# EAGLE design LiDAR_Lite_Interface_CAN (EAGLE 9.4.2)
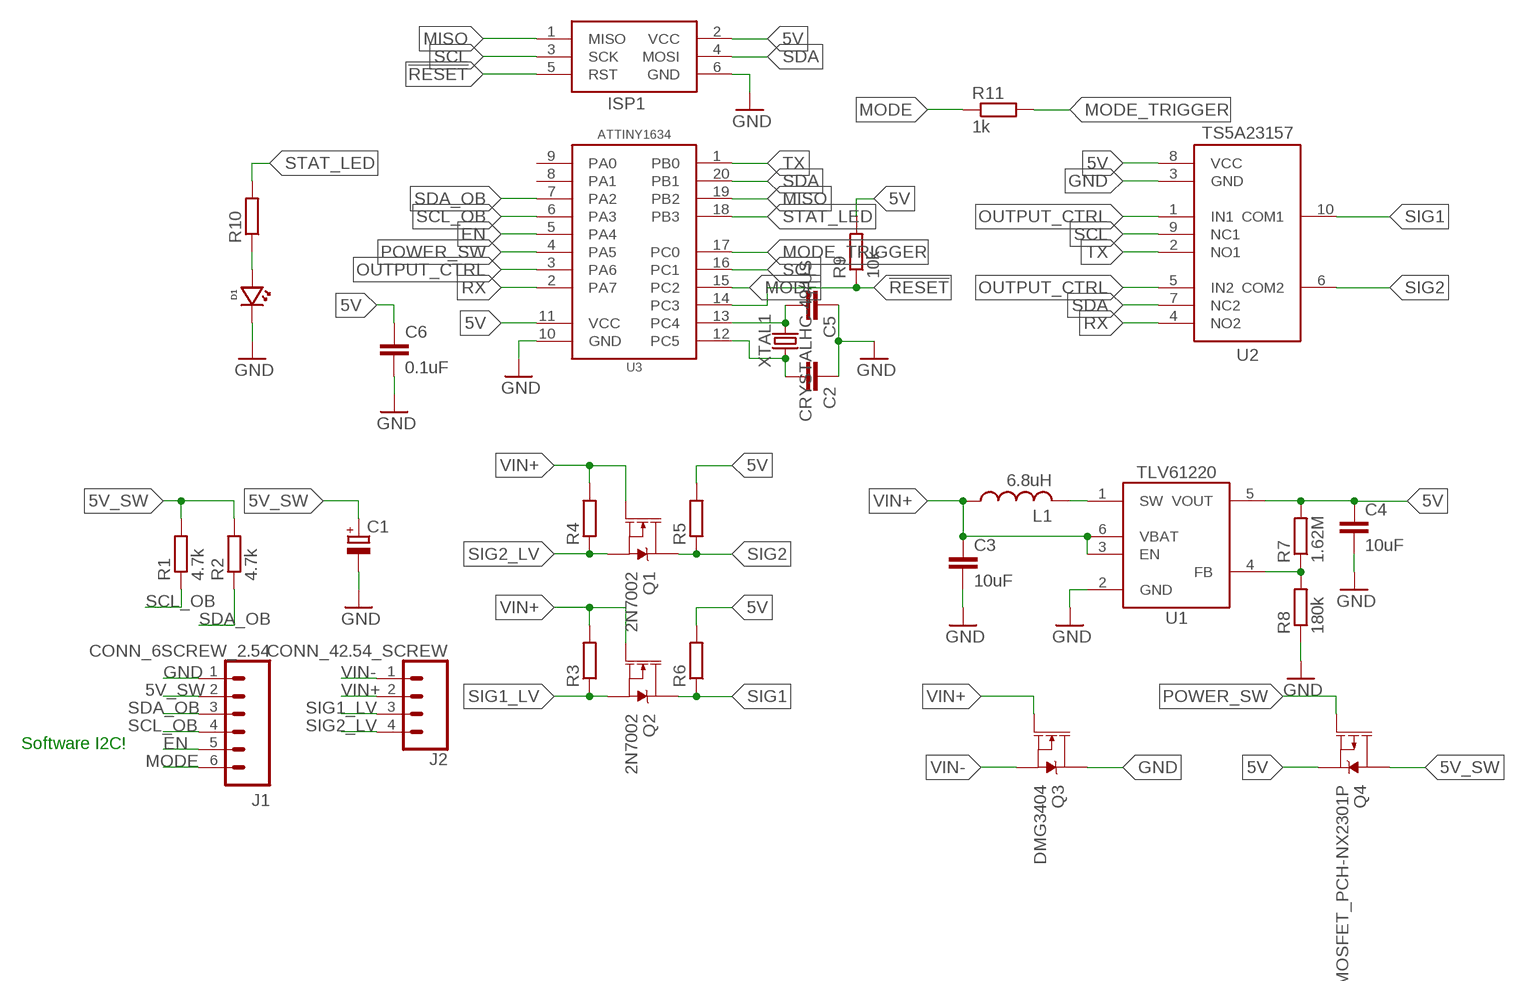
[diagram p0: schematic, sheet 1]

## Parts
C1  CPOL-EUUW-10X10  [UW-10X10_NICHICON]
C2  C-EU10PFC0603  [C0603]
C3  10uF  C-EU10UFC0805  [C0805]
C4  10uF  C-EU10UFC0805  [C0805]
C5  C-EU10PFC0603  [C0603]
C6  0.1uF  C-EU0.1UFC0603  [C0603]
D1  LED0603  [LED_0603]
ISP1  AVRISP-6  [AVRISP]
J1  CONN_6SCREW_2.54  [1X06_SCREW]
J2  CONN_42.54_SCREW  [1X04_SCREW]
L1  6.8uH  INDUCTOR1008  [1008]
Q1  2N7002  MOSFET-NCH-2N7002P  [SOT23-3]
Q2  2N7002  MOSFET-NCH-2N7002P  [SOT23-3]
Q3  DMG3404  MOSFET-NCH-DMG3404L  [SOT23-3]
Q4  MOSFET_PCH-NX2301P  [SOT23-3]
R1  4.7k  R-EU_4.7KR0603  [R0603]
R2  4.7k  R-EU_4.7KR0603  [R0603]
R3  R-EU_10KR0603  [R0603]
R4  R-EU_10KR0603  [R0603]
R5  R-EU_10KR0603  [R0603]
R6  R-EU_10KR0603  [R0603]
R7  1.62M  R-EU_1.62MR0603  [R0603]
R8  180k  R-EU_180KR0603  [R0603]
R9  10k  R-EU_10KR0603  [R0603]
R10  R-EU_330R0603  [R0603]
R11  1k  R-EU_1KR0603  [R0603]
U1  TLV61220DBV  [DBV_R-PDSO-G6]
U2  TS5A23157DGS  [DGS0010A]
U3  ATTINY1634SOIC  [SO-20DW]
XTAL1  CRYSTALHC-49/US  [HC49UP]

## Nets
5V: C4.1 C6.1 ISP1.2(VCC) Q4.2(S) R5.2 R6.2 R7.2 R9.2 U1.5(VOUT) U2.8(VCC) U3.11(VCC)
5V_SW: C1.+ J1.2 Q4.3(D) R1.2 R2.2
!RESET: ISP1.5(RST) R9.1 U3.14(PC3)
EN: J1.5 U3.5(PA4)
GND: C1.- C2.1 C3.2 C4.2 C5.1 C6.2 D1.CATHODE ISP1.6(GND) J1.1 Q3.3(D) R8.1 U1.2(GND) U2.3(GND) U3.10(GND)
MISO: ISP1.1(MISO) U3.19(PB2)
MODE: J1.6 R11.1 U3.15(PC2)
MODE_TRIGGER: R11.2 U3.17(PC0)
N$1: C5.2 U3.13(PC4) XTAL1.2
N$3: C2.2 U3.12(PC5) XTAL1.1
N$4: D1.ANODE R10.1
N$7: R7.1 R8.2 U1.4(FB)
N$9: L1.2 U1.1(SW)
OUTPUT_CTRL: U2.1(IN1) U2.5(IN2) U3.3(PA6)
POWER_SW: Q4.1(G) U3.4(PA5)
RX: U2.4(NO2) U3.2(PA7)
SCL: ISP1.3(SCK) U2.9(NC1) U3.16(PC1)
SCL_OB: J1.4 R1.1 U3.6(PA3)
SDA: ISP1.4(MOSI) U2.7(NC2) U3.20(PB1)
SDA_OB: J1.3 R2.1 U3.7(PA2)
SIG1: Q2.3(D) R6.1 U2.10(COM1)
SIG1_LV: J2.3 Q2.2(S) R3.1
SIG2: Q1.3(D) R5.1 U2.6(COM2)
SIG2_LV: J2.4 Q1.2(S) R4.1
STAT_LED: R10.2 U3.18(PB3)
TX: U2.2(NO1) U3.1(PB0)
VIN+: C3.1 J2.2 L1.1 Q1.1(G) Q2.1(G) Q3.1(G) R3.2 R4.2 U1.3(EN) U1.6(VBAT)
VIN-: J2.1 Q3.2(S)
Unconnected: U3.8(PA1) U3.9(PA0)

## Notes on the sheet
- Software I2C!

## Library data of the parts
C1 = bschulz_passives:CPOL-EU: POLARIZED CAPACITOR, European symbol
C2 C5 = bschulz_passives:C-EU: CAPACITOR, European symbol; DIGIKEY: 311-1058-1-ND; MF: Yageo; MPN: CC0603JRNPO9BN100CC0603JRNPO9BN100
C3 C4 = bschulz_passives:C-EU: CAPACITOR, European symbol; DIGIKEY: 490-6473-6-ND; MF: Murata; MPN: GRM21BR61C106KE15K
C6 = bschulz_passives:C-EU: CAPACITOR, European symbol; DIGIKEY: 490-6051-1-ND; MF: Murata; MPN: GCM188R71E104KA57D
D1 = bschulz:LED: Genaric LED
ISP1 = bschulz:AVRISP: AVR ISP HEADER Standard 6 pin header for AVR programming
J1 = bschulz:CONN_6: Genaric 6 terminal header Digikey 2.54_SCREW <https://www.digikey.com/product-detail/en/on-shore-technology-inc/OSTVN06A150/ED10565-ND/1588866>; DIGIKEY: ED10565-ND; MF: OnShore; MPN: OSTVN06A150
J2 = bschulz:CONN_4: Genaric 4 terminal header Digikey 2.54_SCREW <https://www.digikey.com/product-detail/en/on-shore-technology-inc/OSTVN04A150/ED10563-ND/1588864>; DIGIKEY: ED10563-ND; MF: On Shore; MPN: OSTVN04A150
L1 = bschulz:INDUCTOR: Genaric inductor; DIGIKEY: 732-4849-1-ND; MF: Wurth; MPN: 74438323068
Q1 Q2 = bschulz:MOSFET-NCH: N-channel MOSFETs Voltage controlled devices that allow control of high current outputs. SparkFun Products: SparkFun OpenScale <https://www.sparkfun.com/products/13261> SparkFun Digital Sandbox <https://www.sparkfun.com/products/12651> SparkFun Monster Moto Shield <https://www.sparkfun.com/products/10182> SparkFun MOSFET Power Controller <https://www.sparkfun.com/products/11214>; DIGIKEY: 1727-4692-1-ND; MF: Nexperia; MPN: 2N7002P,215
Q3 = bschulz:MOSFET-NCH: N-channel MOSFETs Voltage controlled devices that allow control of high current outputs. SparkFun Products: SparkFun OpenScale <https://www.sparkfun.com/products/13261> SparkFun Digital Sandbox <https://www.sparkfun.com/products/12651> SparkFun Monster Moto Shield <https://www.sparkfun.com/products/10182> SparkFun MOSFET Power Controller <https://www.sparkfun.com/products/11214>; DIGIKEY: DMG3404L-7DICT-ND; MF: Diodes Incorporated; MPN: DMG3404L-7
Q4 = bschulz:MOSFET_PCH: P-channel MOSFETs Voltage controlled devices that allow control of high current outputs. SparkFun Products: SparkFun ESP32 Thing <https://www.sparkfun.com/products/13907> SparkFun ESP8266 Thing <https://www.sparkfun.com/products/13231>; DIGIKEY: 1727-1148-1-ND; MF: Nexperia; MPN: NX2301P,215
R1 R2 = bschulz_passives:R-EU_: RESISTOR, European symbol Digikey Parts: Yageo, 0402 <https://www.digikey.com/products/en/resistors/chip-resistor-surface-mount/52?k=&pkeyword=&sf=0&FV=ffec1104%2Cfffc000d%2C1c0002%2C440067%2C1f140000%2Cffe00034%2C400004&quantity=&ColumnSort=0&page=1&stock=1&pageSize=25> Yageo, 0603 <https://www.digikey.com/products/en/resistors/chip-resistor-surface-mount/52?k=&pkeyword=&s=4356&s=47360&sf=0&FV=fffc000d%2C1c0002%2C142c040c%2C1f140000%2Cffe00034&quantity=10&ColumnSort=1000011&page=1&stock=1&pageSize=25> Panasonic, 0603 <https://www.digikey.com/products/en/resistors/chip-resistor-surface-mount/52?k=&pkeyword=&pv252=68&sf=0&FV=ffec373d%2C1c0002%2C142c040c%2C1f140000%2Cffe00034%2C80002%2Cc0001&quantity=&ColumnSort=0&page=1&stock=1&pageSize=25> Panasonic, precision, 0603 <https://www.digikey.com/products/en/resistors/chip-resistor-surface-mount/52?FV=ffec4907%2Cfffc000a%2Cc0172%2C142c040c%2C1f140000%2Cffe00034%2C1c0002&quantity=100&ColumnSort=2085&page=1&stock=1&pageSize=25> Panasonic, 0805 <https://www.digikey.com/products/en/resistors/chip-resistor-surface-mount/52?k=&pkeyword=&pv3=1&sf=0&FV=ffec373d%2C1c0002%2C1f140000%2Cffe00034%2C142c040d&quantity=&ColumnSort=0&page=1&stock=1&pageSize=25> Rohm, current sense <https://www.digikey.com/products/en/resistors/chip-resistor-surface-mount/52?k=&pkeyword=&pv3=1&sf=0&FV=ffecb688%2C1f140000%2Cffe00034%2C1c0002&quantity=&ColumnSort=0&page=1&stock=1&pageSize=25> Vishay, pulse proof automotive <https://www.digikey.com/products/en/resistors/chip-resistor-surface-mount/52?k=&pkeyword=&pv7=2&sf=0&FV=ffec5d6b%2Cffe00034%2C1f140000&quantity=&ColumnSort=0&page=1&stock=1&pageSize=25>; DIGIKEY: 311-4.70KHRCT-ND; MF: Yageo; MPN: RC0603FR-074K7L; VALUE_PART: 4.7k
R3-R6 R9 = bschulz_passives:R-EU_: RESISTOR, European symbol Digikey Parts: Yageo, 0402 <https://www.digikey.com/products/en/resistors/chip-resistor-surface-mount/52?k=&pkeyword=&sf=0&FV=ffec1104%2Cfffc000d%2C1c0002%2C440067%2C1f140000%2Cffe00034%2C400004&quantity=&ColumnSort=0&page=1&stock=1&pageSize=25> Yageo, 0603 <https://www.digikey.com/products/en/resistors/chip-resistor-surface-mount/52?k=&pkeyword=&s=4356&s=47360&sf=0&FV=fffc000d%2C1c0002%2C142c040c%2C1f140000%2Cffe00034&quantity=10&ColumnSort=1000011&page=1&stock=1&pageSize=25> Panasonic, 0603 <https://www.digikey.com/products/en/resistors/chip-resistor-surface-mount/52?k=&pkeyword=&pv252=68&sf=0&FV=ffec373d%2C1c0002%2C142c040c%2C1f140000%2Cffe00034%2C80002%2Cc0001&quantity=&ColumnSort=0&page=1&stock=1&pageSize=25> Panasonic, precision, 0603 <https://www.digikey.com/products/en/resistors/chip-resistor-surface-mount/52?FV=ffec4907%2Cfffc000a%2Cc0172%2C142c040c%2C1f140000%2Cffe00034%2C1c0002&quantity=100&ColumnSort=2085&page=1&stock=1&pageSize=25> Panasonic, 0805 <https://www.digikey.com/products/en/resistors/chip-resistor-surface-mount/52?k=&pkeyword=&pv3=1&sf=0&FV=ffec373d%2C1c0002%2C1f140000%2Cffe00034%2C142c040d&quantity=&ColumnSort=0&page=1&stock=1&pageSize=25> Rohm, current sense <https://www.digikey.com/products/en/resistors/chip-resistor-surface-mount/52?k=&pkeyword=&pv3=1&sf=0&FV=ffecb688%2C1f140000%2Cffe00034%2C1c0002&quantity=&ColumnSort=0&page=1&stock=1&pageSize=25> Vishay, pulse proof automotive <https://www.digikey.com/products/en/resistors/chip-resistor-surface-mount/52?k=&pkeyword=&pv7=2&sf=0&FV=ffec5d6b%2Cffe00034%2C1f140000&quantity=&ColumnSort=0&page=1&stock=1&pageSize=25>; DIGIKEY: 311-10.0KHRCT-ND; MF: Yageo; MPN: RC0603FR-0710KL; VALUE_PART: 10k
R7 = bschulz_passives:R-EU_: RESISTOR, European symbol Digikey Parts: Yageo, 0402 <https://www.digikey.com/products/en/resistors/chip-resistor-surface-mount/52?k=&pkeyword=&sf=0&FV=ffec1104%2Cfffc000d%2C1c0002%2C440067%2C1f140000%2Cffe00034%2C400004&quantity=&ColumnSort=0&page=1&stock=1&pageSize=25> Yageo, 0603 <https://www.digikey.com/products/en/resistors/chip-resistor-surface-mount/52?k=&pkeyword=&s=4356&s=47360&sf=0&FV=fffc000d%2C1c0002%2C142c040c%2C1f140000%2Cffe00034&quantity=10&ColumnSort=1000011&page=1&stock=1&pageSize=25> Panasonic, 0603 <https://www.digikey.com/products/en/resistors/chip-resistor-surface-mount/52?k=&pkeyword=&pv252=68&sf=0&FV=ffec373d%2C1c0002%2C142c040c%2C1f140000%2Cffe00034%2C80002%2Cc0001&quantity=&ColumnSort=0&page=1&stock=1&pageSize=25> Panasonic, precision, 0603 <https://www.digikey.com/products/en/resistors/chip-resistor-surface-mount/52?FV=ffec4907%2Cfffc000a%2Cc0172%2C142c040c%2C1f140000%2Cffe00034%2C1c0002&quantity=100&ColumnSort=2085&page=1&stock=1&pageSize=25> Panasonic, 0805 <https://www.digikey.com/products/en/resistors/chip-resistor-surface-mount/52?k=&pkeyword=&pv3=1&sf=0&FV=ffec373d%2C1c0002%2C1f140000%2Cffe00034%2C142c040d&quantity=&ColumnSort=0&page=1&stock=1&pageSize=25> Rohm, current sense <https://www.digikey.com/products/en/resistors/chip-resistor-surface-mount/52?k=&pkeyword=&pv3=1&sf=0&FV=ffecb688%2C1f140000%2Cffe00034%2C1c0002&quantity=&ColumnSort=0&page=1&stock=1&pageSize=25> Vishay, pulse proof automotive <https://www.digikey.com/products/en/resistors/chip-resistor-surface-mount/52?k=&pkeyword=&pv7=2&sf=0&FV=ffec5d6b%2Cffe00034%2C1f140000&quantity=&ColumnSort=0&page=1&stock=1&pageSize=25>; DIGIKEY: RMCF0603FT1M62CT-ND; MF: Stackpole; MPN: RMCF0603FT1M62; VALUE_PART: 1.62M
R8 = bschulz_passives:R-EU_: RESISTOR, European symbol Digikey Parts: Yageo, 0402 <https://www.digikey.com/products/en/resistors/chip-resistor-surface-mount/52?k=&pkeyword=&sf=0&FV=ffec1104%2Cfffc000d%2C1c0002%2C440067%2C1f140000%2Cffe00034%2C400004&quantity=&ColumnSort=0&page=1&stock=1&pageSize=25> Yageo, 0603 <https://www.digikey.com/products/en/resistors/chip-resistor-surface-mount/52?k=&pkeyword=&s=4356&s=47360&sf=0&FV=fffc000d%2C1c0002%2C142c040c%2C1f140000%2Cffe00034&quantity=10&ColumnSort=1000011&page=1&stock=1&pageSize=25> Panasonic, 0603 <https://www.digikey.com/products/en/resistors/chip-resistor-surface-mount/52?k=&pkeyword=&pv252=68&sf=0&FV=ffec373d%2C1c0002%2C142c040c%2C1f140000%2Cffe00034%2C80002%2Cc0001&quantity=&ColumnSort=0&page=1&stock=1&pageSize=25> Panasonic, precision, 0603 <https://www.digikey.com/products/en/resistors/chip-resistor-surface-mount/52?FV=ffec4907%2Cfffc000a%2Cc0172%2C142c040c%2C1f140000%2Cffe00034%2C1c0002&quantity=100&ColumnSort=2085&page=1&stock=1&pageSize=25> Panasonic, 0805 <https://www.digikey.com/products/en/resistors/chip-resistor-surface-mount/52?k=&pkeyword=&pv3=1&sf=0&FV=ffec373d%2C1c0002%2C1f140000%2Cffe00034%2C142c040d&quantity=&ColumnSort=0&page=1&stock=1&pageSize=25> Rohm, current sense <https://www.digikey.com/products/en/resistors/chip-resistor-surface-mount/52?k=&pkeyword=&pv3=1&sf=0&FV=ffecb688%2C1f140000%2Cffe00034%2C1c0002&quantity=&ColumnSort=0&page=1&stock=1&pageSize=25> Vishay, pulse proof automotive <https://www.digikey.com/products/en/resistors/chip-resistor-surface-mount/52?k=&pkeyword=&pv7=2&sf=0&FV=ffec5d6b%2Cffe00034%2C1f140000&quantity=&ColumnSort=0&page=1&stock=1&pageSize=25>; DIGIKEY: P180KHCT-ND; MF: Panasonic; MPN: ERJ-3EKF1803V; VALUE_PART: 180k
R10 = bschulz_passives:R-EU_: RESISTOR, European symbol Digikey Parts: Yageo, 0402 <https://www.digikey.com/products/en/resistors/chip-resistor-surface-mount/52?k=&pkeyword=&sf=0&FV=ffec1104%2Cfffc000d%2C1c0002%2C440067%2C1f140000%2Cffe00034%2C400004&quantity=&ColumnSort=0&page=1&stock=1&pageSize=25> Yageo, 0603 <https://www.digikey.com/products/en/resistors/chip-resistor-surface-mount/52?k=&pkeyword=&s=4356&s=47360&sf=0&FV=fffc000d%2C1c0002%2C142c040c%2C1f140000%2Cffe00034&quantity=10&ColumnSort=1000011&page=1&stock=1&pageSize=25> Panasonic, 0603 <https://www.digikey.com/products/en/resistors/chip-resistor-surface-mount/52?k=&pkeyword=&pv252=68&sf=0&FV=ffec373d%2C1c0002%2C142c040c%2C1f140000%2Cffe00034%2C80002%2Cc0001&quantity=&ColumnSort=0&page=1&stock=1&pageSize=25> Panasonic, precision, 0603 <https://www.digikey.com/products/en/resistors/chip-resistor-surface-mount/52?FV=ffec4907%2Cfffc000a%2Cc0172%2C142c040c%2C1f140000%2Cffe00034%2C1c0002&quantity=100&ColumnSort=2085&page=1&stock=1&pageSize=25> Panasonic, 0805 <https://www.digikey.com/products/en/resistors/chip-resistor-surface-mount/52?k=&pkeyword=&pv3=1&sf=0&FV=ffec373d%2C1c0002%2C1f140000%2Cffe00034%2C142c040d&quantity=&ColumnSort=0&page=1&stock=1&pageSize=25> Rohm, current sense <https://www.digikey.com/products/en/resistors/chip-resistor-surface-mount/52?k=&pkeyword=&pv3=1&sf=0&FV=ffecb688%2C1f140000%2Cffe00034%2C1c0002&quantity=&ColumnSort=0&page=1&stock=1&pageSize=25> Vishay, pulse proof automotive <https://www.digikey.com/products/en/resistors/chip-resistor-surface-mount/52?k=&pkeyword=&pv7=2&sf=0&FV=ffec5d6b%2Cffe00034%2C1f140000&quantity=&ColumnSort=0&page=1&stock=1&pageSize=25>; DIGIKEY: 311-330HRCT-ND; MF: Yageo; MPN: RC0603FR-07330RL; VALUE_PART: 330
R11 = bschulz_passives:R-EU_: RESISTOR, European symbol Digikey Parts: Yageo, 0402 <https://www.digikey.com/products/en/resistors/chip-resistor-surface-mount/52?k=&pkeyword=&sf=0&FV=ffec1104%2Cfffc000d%2C1c0002%2C440067%2C1f140000%2Cffe00034%2C400004&quantity=&ColumnSort=0&page=1&stock=1&pageSize=25> Yageo, 0603 <https://www.digikey.com/products/en/resistors/chip-resistor-surface-mount/52?k=&pkeyword=&s=4356&s=47360&sf=0&FV=fffc000d%2C1c0002%2C142c040c%2C1f140000%2Cffe00034&quantity=10&ColumnSort=1000011&page=1&stock=1&pageSize=25> Panasonic, 0603 <https://www.digikey.com/products/en/resistors/chip-resistor-surface-mount/52?k=&pkeyword=&pv252=68&sf=0&FV=ffec373d%2C1c0002%2C142c040c%2C1f140000%2Cffe00034%2C80002%2Cc0001&quantity=&ColumnSort=0&page=1&stock=1&pageSize=25> Panasonic, precision, 0603 <https://www.digikey.com/products/en/resistors/chip-resistor-surface-mount/52?FV=ffec4907%2Cfffc000a%2Cc0172%2C142c040c%2C1f140000%2Cffe00034%2C1c0002&quantity=100&ColumnSort=2085&page=1&stock=1&pageSize=25> Panasonic, 0805 <https://www.digikey.com/products/en/resistors/chip-resistor-surface-mount/52?k=&pkeyword=&pv3=1&sf=0&FV=ffec373d%2C1c0002%2C1f140000%2Cffe00034%2C142c040d&quantity=&ColumnSort=0&page=1&stock=1&pageSize=25> Rohm, current sense <https://www.digikey.com/products/en/resistors/chip-resistor-surface-mount/52?k=&pkeyword=&pv3=1&sf=0&FV=ffecb688%2C1f140000%2Cffe00034%2C1c0002&quantity=&ColumnSort=0&page=1&stock=1&pageSize=25> Vishay, pulse proof automotive <https://www.digikey.com/products/en/resistors/chip-resistor-surface-mount/52?k=&pkeyword=&pv7=2&sf=0&FV=ffec5d6b%2Cffe00034%2C1f140000&quantity=&ColumnSort=0&page=1&stock=1&pageSize=25>; DIGIKEY: 311-1KLDCT-ND; MF: Yageo; MPN: AC0603FR-071KL; VALUE_PART: 1k
U1 = bschulz:TLV61220: TLV61220 - Low-Input Voltage Step-Up Converter (Boost) Characteristics: Vin: 0.7V ~ 5.5V Vout: 1.8V ~ 5.5V Output Current (Max): 400 mA IQ: 5μA Operating Temperature: -40°C to 85°C Digikey: 296-30547-1-ND <https://www.digikey.com/product-detail/en/texas-instruments/TLV61220DBVR/296-30547-1-ND/3458120>; DIGIKEY: 296-30547-1-ND; MF: TI; MPN: TLV61220DBVR
U2 = bschulz:TS5A23157: TS5A23157 - 2 Channel Multiplexer DPDT Analog Switch Characteristics: VCC: 1.65~5.5V Operating Temperature: -40°C to 85°C On state resistace: 10 Ω, Typ Channel to Channel Matching: 0.15 Ω, Typical Digikey: 296-21919-1-ND (UQFN, RSE) <https://www.digikey.com/product-detail/en/texas-instruments/TS5A23157RSER/296-21919-1-ND/1629272> 296-17076-1-ND (VSSOP, DGS) <https://www.digikey.com/product-detail/en/texas-instruments/TS5A23157DGSR/296-17076-1-ND/659982>; DIGIKEY: 296-17076-1-ND; DISP: TS5A23157; MF: TI; MPN: TS5A23157DGSR
U3 = bschulz:ATTINY1634: ATtiny1634 8 bit AVR Microcontroller Features: Vcc: 1.8 ~ 5.5V Clock: Up to 16MHz, Internal 8MHz FRC, 32kHz RC Flash Memory: 16K SRAM: 1K EEPROM: 256B ADC: 10b, 12 port USART: Yes, x2 SPI: Yes I2C: Yes, slave only Notes: 2 analog comp. Digikey: ATTINY1634R-MURCT-ND (QFN) <https://www.digikey.com/product-detail/en/microchip-technology/ATTINY1634R-MUR/ATTINY1634R-MURCT-ND/3440781> ATTINY1634R-SU-ND (SOIC) <https://www.digikey.com/product-detail/en/ATTINY1634R-SU/ATTINY1634R-SU-ND/3128699/?itemSeq=272981030>; DIGIKEY: ATTINY1634-SURCT-ND; MF: Atmel; MPN: ATTINY1634-SUR
XTAL1 = bschulz:CRYSTAL: Crystal Oscilator 2 Pin quartz crystal oscilators Variants 3.2x1.5mm (Only available in 32.768kHz) <https://www.digikey.com/products/en/crystals-oscillators-resonators/crystals/171?FV=b839bf%2Cb83a33%2C8640001%2C864000f%2C8640003%2C1f140000%2Cmu32.768kHz%7C2150%2Cffe000ab&quantity=10&ColumnSort=1000011&page=1&stock=1&k=crystal&pageSize=25&pkeyword=crystal> 5 x 3.2mm (8MHz ~ 50MHz) <https://www.digikey.com/products/en/crystals-oscillators-resonators/crystals/171?FV=402f3e%2Cb8434d%2C1f140000%2Cffe000ab&quantity=10&ColumnSort=1000011&page=1&stock=1&pageSize=25>

## Board
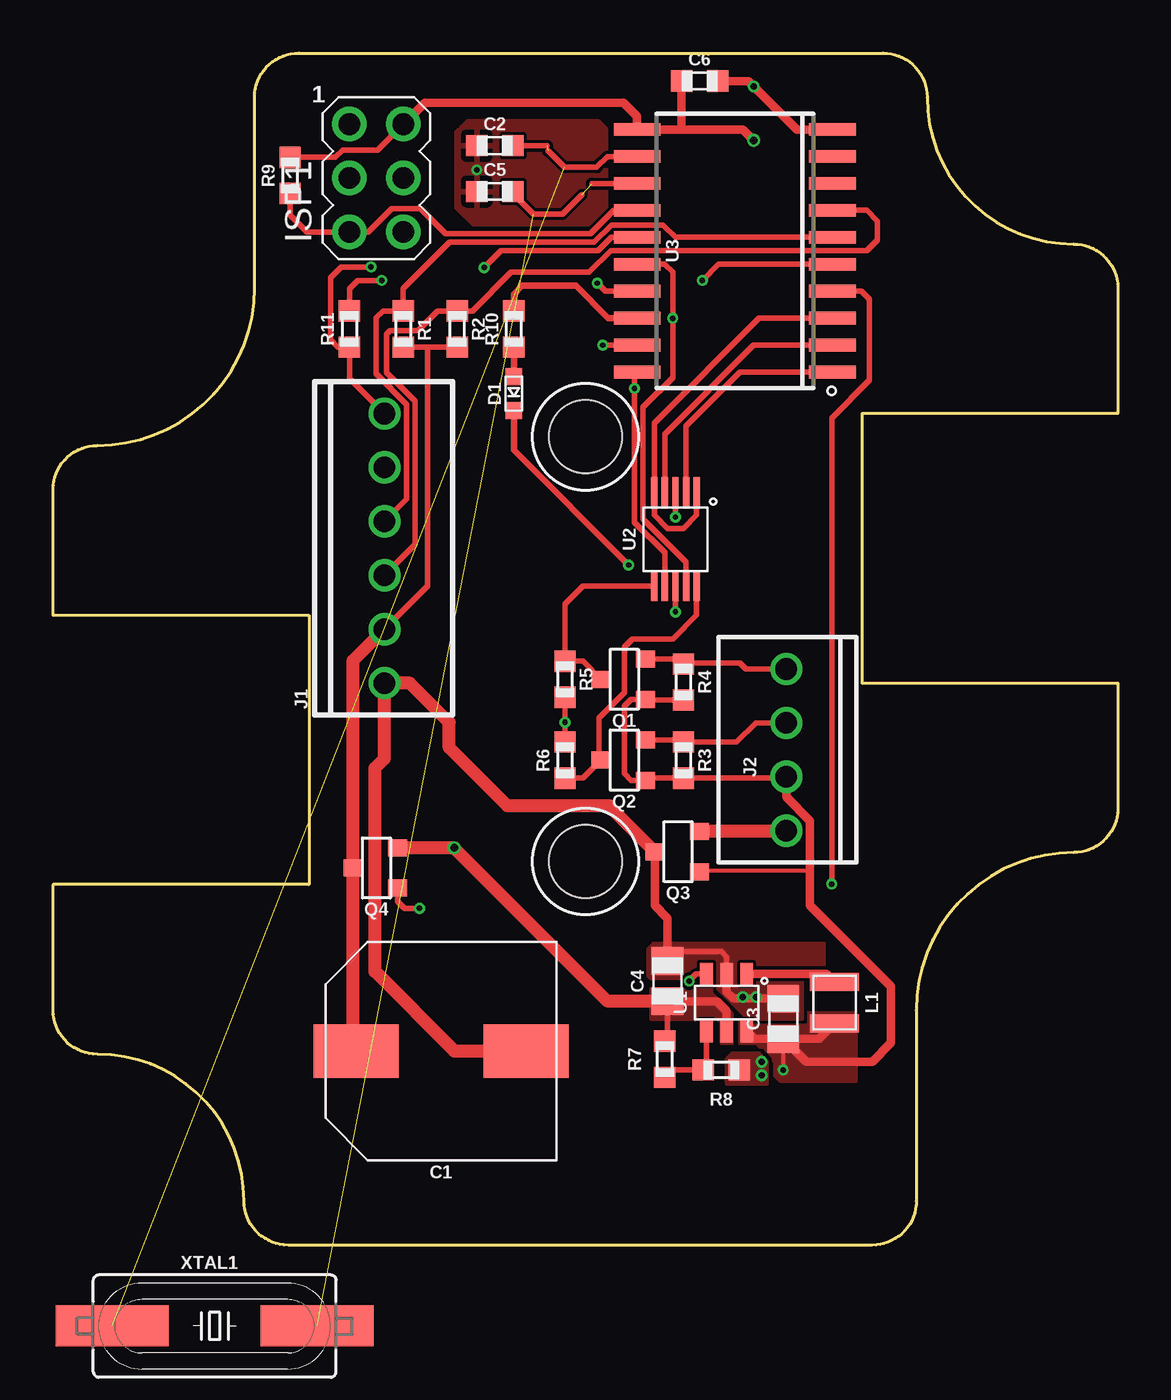
[diagram p1: board, top side]
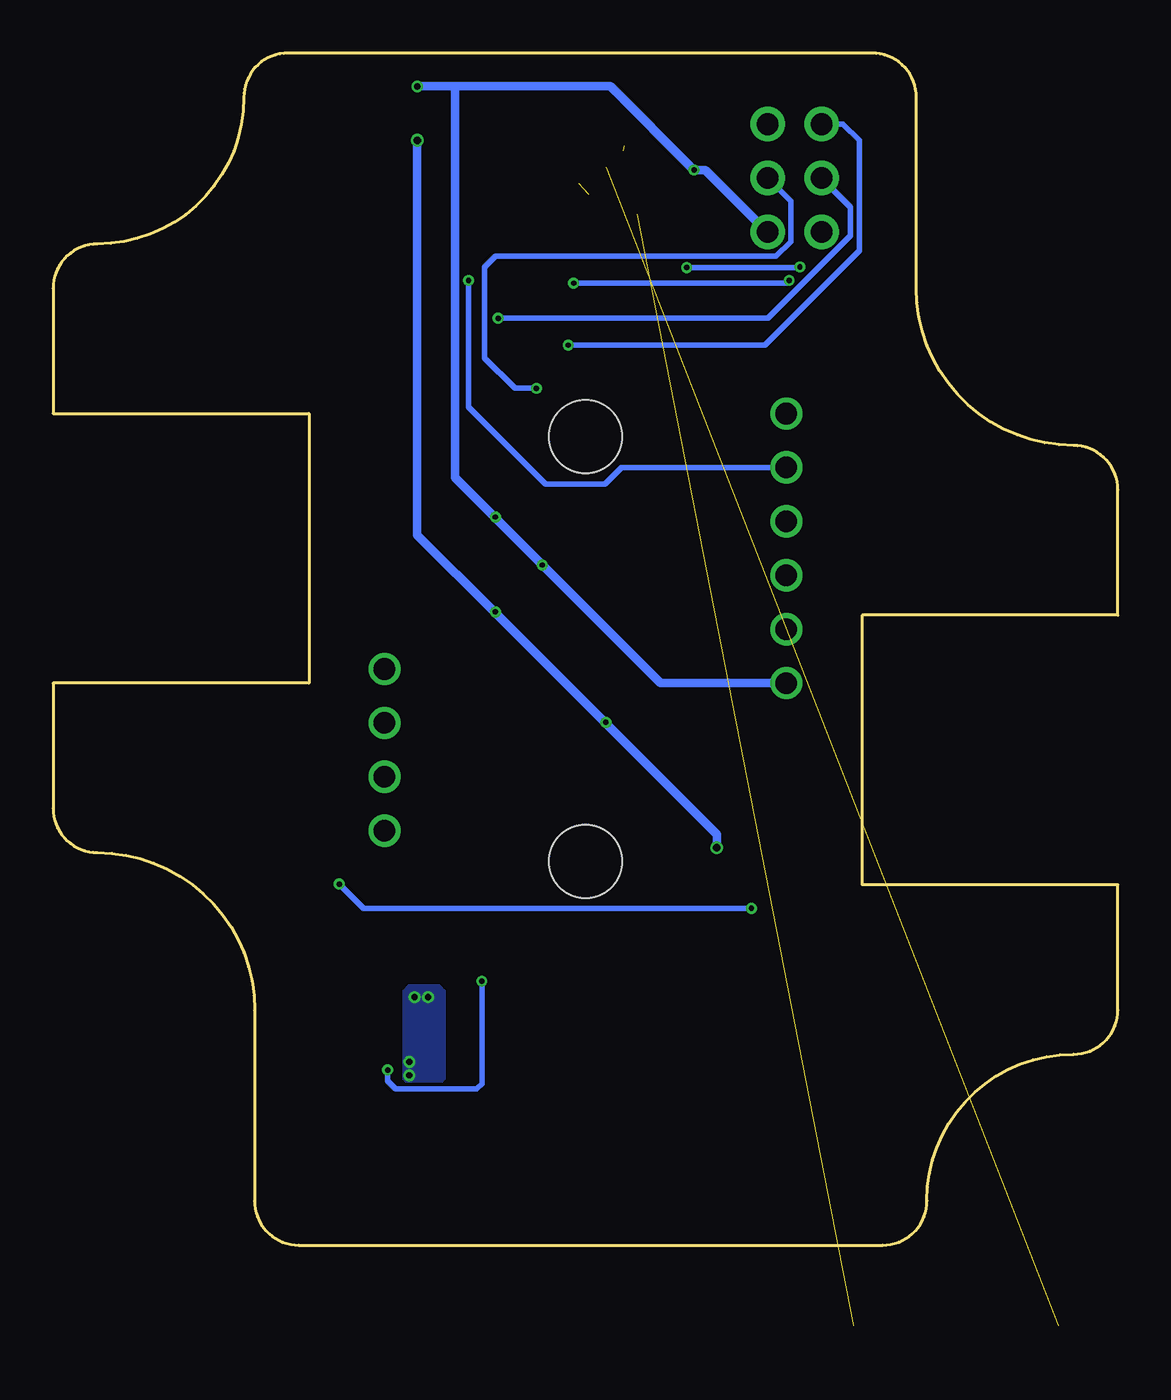
[diagram p2: board, bottom side, seen from below]

Size 50.19 x 56.18 mm. Coordinates in mm from the lower left corner, seen from the top.
Outline: 2.08,37.69 arc90 0,35.61 0,29.69 12.06,29.69 12.06,16.99 0,16.99 0,11.08 arc90 2.08,9 2.1,9 arc-90 9,2.1 9,2.08 arc90 11.08,0 38.61,0 arc90 40.69,2.08 40.69,11.08 arc-90 48.11,18.5
Outline: 2.08,37.69 2.08,37.69
Outline: 2.08,37.69 arc90 9.5,45.11 9.5,54.1 arc-90 11.58,56.19 39.12,56.19 arc-90 41.2,54.1 41.2,54.09 arc90 48.1,47.19 48.11,47.19 arc-90 50.19,45.1 50.19,39.19 38.12,39.19 38.12,26.49 50.19,26.49 50.19,20.58 arc-90 48.11,18.5
Outline: 48.11,18.5 48.11,18.5
Copper layers (1*16): Top 0.035559375mm / dielectric 1.6mm / Bottom 0.035559375mm
Design rules "oshpark-2layer": minimum track width 6mil, minimum drill 10mil, track to track 6mil, track to pad 6mil, pad to pad 6mil, via to via 6mil, smd to smd 6mil, copper to edge 15mil, drill to drill 6mil, minimum pad ring 5mil, minimum via ring 5mil, stop-mask expansion 2.5mil, vias tented up to drill 0mil, thermal gap 10mil
Holes 3.43 mm at 25.1,18.08 25.1,38.1

### Footprints (pad centres in the part's own frame; a part is rotated, then mirrored left to right if it is on the bottom)
UW-10X10_NICHICON = smd 2.5 x 4: + 0,4; - 0,-4
C0603 = smd 1 x 1: 1 -0.85,0; 2 0.85,0
C0805 = smd 1.3 x 1.5: 1 -0.95,0; 2 0.95,0
LED_0603 = smd 0.8 x 0.8: ANODE 0.8,0; CATHODE -0.8,0
AVRISP = drill 1.02 pad 1.626: 1 -1.27,2.54; 2 1.27,2.54; 3 -1.27,0; 4 1.27,0; 5 -1.27,-2.54; 6 1.27,-2.54
1X06_SCREW = drill 1.016: 1 -6.35,0; 2 -3.81,0; 3 -1.27,0; 4 1.27,0; 5 3.81,0; 6 6.35,0
1X04_SCREW = drill 1.016: 1 -3.81,0; 2 -1.27,0; 3 1.27,0; 4 3.81,0
1008 = smd 0.85 x 2.3: 1 -0.975,0; 2 0.975,0
SOT23-3 = smd 0.8 x 0.9: 1 -0.95,-1; 2 0.95,-1; 3 0,1.1
R0603 = smd 1 x 1: 1 -0.85,0; 2 0.85,0
DBV_R-PDSO-G6 = smd 0.6 x 1.05: 1 -0.95,-1.35; 2 0,-1.35; 3 0.95,-1.35; 4 0.95,1.35; 5 0,1.35; 6 -0.95,1.35
DGS0010A = smd 1.45 x 0.3: 1 -2.2,1; 2 -2.2,0.5; 3 -2.2,0; 4 -2.2,-0.5; 5 -2.2,-1; 6 2.2,-1; 7 2.2,-0.5; 8 2.2,0; 9 2.2,0.5; 10 2.2,1
SO-20DW = smd 0.6 x 2.2: 1 -5.715,-4.6; 2 -4.445,-4.6; 3 -3.175,-4.6; 4 -1.905,-4.6; 5 -0.635,-4.6; 6 0.635,-4.6; 7 1.905,-4.6; 8 3.175,-4.6; 9 4.445,-4.6; 10 5.715,-4.6; 11 5.715,4.6; 12 4.445,4.6; 13 3.175,4.6; 14 1.905,4.6; 15 0.635,4.6; 16 -0.635,4.6; 17 -1.905,4.6; 18 -3.175,4.6; 19 -4.445,4.6; 20 -5.715,4.6
HC49UP = smd 5.334 x 1.93: 1 -4.826,0; 2 4.826,0

### Placement (x,y rotation side)
C1  18.29,9.14 90 top
C2  20.83,51.82 0 top
C3  34.42,10.67 90 top
C4  28.96,12.45 90 top
C5  20.83,49.66 0 top
C6  30.48,54.86 0 top
D1  21.72,40.13 90 top
ISP1  15.24,50.29 0 top
J1  15.62,32.84 90 top
J2  34.56,23.34 90 top
L1  36.83,11.43 90 top
Q1  26.92,26.67 90 top
Q2  26.92,22.86 90 top
Q3  29.46,18.54 90 top
Q4  15.24,17.78 90 top
R1  16.51,43.18 270 top
R2  19.05,43.18 270 top
R3  29.72,22.86 270 top
R4  29.72,26.54 270 top
R5  24.13,26.67 270 top
R6  24.13,22.86 90 top
R7  28.83,8.76 90 top
R8  31.5,8.26 180 top
R9  11.18,50.42 90 top
R10  21.72,43.18 90 top
R11  13.97,43.18 90 top
U1  31.75,11.43 180 top
U2  29.34,33.27 270 top
U3  32.13,46.86 90 top
XTAL1  7.62,-3.81 0 top  (outside the outline)

### Tracks (layer width: path | path; a pad name or v marks a point on that pad's centre or on a via)
5V  (via drill 0.25, 0.35)
  Top 0.254: C4.1 28.96,9.74 R7.2 | R5.2 v24.13,24.64 R6.2 | U2.8 v29.34,29.84 | R9.2 13.3,51.27 13.64,51.61 15.29,51.61 ISP1.2
  Top 0.406: C4.1 31.3,11.5 31.75,11.05 U1.5 | v33.02,52.07 32.51,52.58 29.59,52.58 | 29.59,52.58 U3.11 27.53,53.21 26.9,53.85 17.53,53.85 ISP1.2 | C6.1 29.63,52.62 29.59,52.58
  Top 0.61: C4.1 26.14,11.5 v18.91,18.73 Q4.2
  Bottom 0.254: v29.34,29.84 29.36,29.82
  Bottom 0.406: 24.18,24.64 29.36,29.82 33.02,33.48 v33.02,52.07 | 24.18,24.64 18.91,19.36 v18.91,18.73 | v24.13,24.64 24.18,24.64
  pour Top (rank 2, no thermals): 32,9.53 32,11.3 31.24,12.06 28.19,12.06 28.19,10.67 31.37,10.67 31.5,10.54 31.5,9.53
5V_SW
  Top 0.254: R1.2 17.65,42.33 | 17.65,42.33 R2.2 | J1.2 17.65,31.06 17.65,42.33
  Top 0.61: C1.+ 14.14,9.29 Q4.3 14.14,27.55 J1.2
!RESET
  Top 0.254: U3.14 26.43,48.77 25.34,47.68 18.49,47.68 17.32,48.84 15.95,48.84 14.86,47.75 ISP1.5 11.98,47.75 11.18,48.55 R9.1
EN  (via drill 0.25)
  Top 0.254: v30.61,45.47 31.37,46.23 U3.5
  Bottom 0.254: J1.5 23.4,36.65 24.18,35.88 26.99,35.88 30.61,39.5 v30.61,45.47
GND  (via drill 0.25, 0.3)
  Top 0.254: U1.2 31.75,13.59 31.5,13.84 29.4,13.84 C4.2 | U2.3 v29.34,34.31
  Top 0.305: D1.CATHODE 21.72,37.47 v27.13,32.05
  Top 0.406: U1.2 31.75,11.94 32.07,11.62 C3.2 | C4.2 28.96,15.41 28.36,16 Q3.3 | U3.10 35.05,52.58 v33.02,54.61 32.77,54.86 C6.2
  Top 0.61: Q3.3 26.2,20.7 21.42,20.7 18.67,23.45 18.67,24.64 16.82,26.49 J1.1 15.62,22.94 15.17,22.48 15.17,12.89 18.92,9.14 C1.-
  Bottom 0.406: 31.24,54.61 v33.02,54.61 | 29.41,34.34 31.24,36.17 31.24,54.61 | 29.41,34.34 v27.13,32.05 21.56,26.49 J1.1 | v29.34,34.31 29.36,34.34 29.41,34.34 | ISP1.6 19.43,50.67 v19.98,50.67 23.91,54.61 31.24,54.61
  other vias: 32.51,11.68 33.15,11.68 33.4,8.64 33.4,8
  pour Bottom: 33.66,7.87 33.53,7.75 31.88,7.75 31.75,7.87 31.75,11.94 32,12.19 33.4,12.19 33.66,11.94
  pour Top (no thermals): 32,9.02 31.75,8.76 31.75,7.62 33.66,7.62 33.66,8.64 33.27,9.02
  pour Top (no thermals): 31.24,12.57 28.19,12.57 28.07,12.7 28.07,13.97 28.32,14.22 36.32,14.22 36.32,12.57 35.31,12.57 35.31,10.67 32.77,10.67 31.24,12.19
  pour Top: 19.05,52.45 19.56,52.96 25.65,52.96 26.04,52.58 26.04,48.64 25.53,48.13 19.81,48.13 19.05,48.9
MISO  (via drill 0.25)
  Top 0.254: U3.19 v25.91,42.42
  Bottom 0.254: v25.91,42.42 16.64,42.42 12.19,46.86 12.19,52.07 12.95,52.83 ISP1.1
MODE  (via drill 0.25)
  Top 0.254: J1.6 13.97,40.85 R11.1 13.42,42.33 13.08,42.67 13.08,45.59 13.59,46.1 v14.99,46.1 | U3.15 26.31,47.5 25.68,46.86 21.11,46.86 v20.32,46.08
  Bottom 0.254: v20.32,46.08 15.01,46.08 v14.99,46.1
MODE_TRIGGER  (via drill 0.25)
  Top 0.254: U3.17 26.04,44.96 v25.65,45.34 | v15.49,45.47 14.35,45.47 13.97,45.09 R11.2
  Bottom 0.254: v25.65,45.34 15.62,45.34 v15.49,45.47
N$1  (2 unrouted)
  Top 0.254: 25.39,50.04 U3.13 | 24.93,49.5 24.02,48.59 22.64,48.59 21.68,49.55 C5.2
N$3  (2 unrouted)
  Top 0.254: U3.12 26.14,51.31 25.62,50.79 24.11,50.79 23.33,51.58 | C2.2 23.29,51.82
N$4
  Top 0.305: R10.1 D1.ANODE
N$7
  Top 0.254: U1.4 30.8,8.41 R8.2 29.17,8.26 R7.1
N$9
  Top 0.406: L1.2 36.45,12.78 U1.1
OUTPUT_CTRL
  Top 0.254: U2.1 30.34,34.4 29.72,33.78 28.96,33.78 28.34,34.4 U2.5 28.34,38.75 33.27,43.69 U3.3
POWER_SW  (via drill 0.25)
  Top 0.254: U3.4 38.1,44.96 38.48,44.58 38.48,40.77 36.7,38.99 v36.7,17.02 | v17.27,15.88 16.56,15.88 16.24,16.2 Q4.1
  Bottom 0.254: v17.27,15.88 24.16,15.88 24.18,15.86 35.55,15.86 v36.7,17.02
RX
  Top 0.254: U2.4 28.84,38.23 33.02,42.42 U3.2
SCL  (via drill 0.25)
  Top 0.254: U2.9 29.84,32.21 27.81,34.23 27.81,39.49 29.21,40.89 v29.21,43.69 29.21,45.85 28.83,46.23 U3.16
  Bottom 0.254: v29.21,43.69 16.49,43.69 12.6,47.58 12.6,48.92 ISP1.3
SCL_OB
  Top 0.254: J1.4 16.67,35.15 16.67,39.62 15.22,41.07 15.22,43.71 15.54,44.03 R1.1 16.51,45.09 18.69,47.27 25.51,47.27 26.32,48.08 28.76,48.08 29.34,47.5 U3.6
SDA  (via drill 0.25)
  Top 0.254: U2.7 28.84,32.63 27.4,34.06 v27.4,40.39 27.4,41.02 U3.20
  Bottom 0.254: v27.4,40.39 28.42,40.39 29.84,41.81 29.84,46.1 29.34,46.61 16.11,46.61 15.42,47.3 15.42,49.2 ISP1.4
SDA_OB
  Top 0.254: J1.3 17.07,33.02 17.07,39.79 15.73,41.13 15.73,42.95 15.89,43.11 17.2,43.11 18.12,44.03 18.92,44.03 R2.1 19.77,44.03 21.59,45.85 25.27,45.85 26.29,46.86 27.56,46.86 27.94,46.86 38.35,46.86 38.86,47.37 38.86,48.26 38.35,48.77 U3.7
SIG1
  Top 0.254: Q2.3 25.74,22.77 | 25.74,22.77 24.97,22.01 R6.1 | U2.10 30.34,29.7 29.21,28.57 27.3,28.57 26.92,28.19 26.92,26.04 25.74,24.85 25.74,22.77
SIG1_LV
  Top 0.254: Q2.2 29.62,23.81 R3.1 32.22,23.71 33.12,24.61 J2.3
SIG2
  Top 0.254: Q1.3 24.97,27.52 R5.1 24.13,30.23 24.98,31.07 U2.6
SIG2_LV
  Top 0.254: J2.4 32.66,27.15 32.38,27.43 29.76,27.43 R4.1 29.49,27.62 Q1.2
STAT_LED
  Top 0.305: R10.2 21.72,44.83 22.1,45.21 24.64,45.21 26.16,43.69 U3.18
TX
  Top 0.254: U2.2 29.84,38.6 32.38,41.15 U3.1
VIN+  (via drill 0.25)
  Top 0.2: v34.42,8.26 C3.1 | Q3.1 30.52,17.65 35.68,17.65
  Top 0.254: U1.3 30.32,12.78 v29.98,12.45 | J2.2 34.5,22.01 R3.2 28.02,22.01 Q2.1 27.24,21.91 26.92,22.23 26.92,25.4 27.24,25.72 Q1.1 27.95,25.69 R4.2
  Top 0.406: C3.1 36.09,9.72 L1.1 | U1.6 33.06,9.72 C3.1 | C3.1 35.5,8.64 38.61,8.64 39.5,9.53 39.5,12.19 35.68,16.01 35.68,17.65 35.68,20 34.56,21.11 J2.2
  Bottom 0.254: v29.98,12.45 29.98,7.61 30.23,7.37 34.04,7.37 34.42,7.75 v34.42,8.26
  pour Top (rank 2, no thermals): 32.38,10.79 32.38,9.53 33.15,9.53 34.04,8.64 34.04,8 34.29,7.75 37.85,7.75 37.85,10.92 35.56,10.92 35.05,10.41 33.4,10.41 33.02,10.79
VIN-
  Top 0.61: J2.1 34.52,19.49 Q3.2